# Altium schematic sheet Sheet2.SchDoc
size A4; SheetNumber: 2; SheetTotal: 2
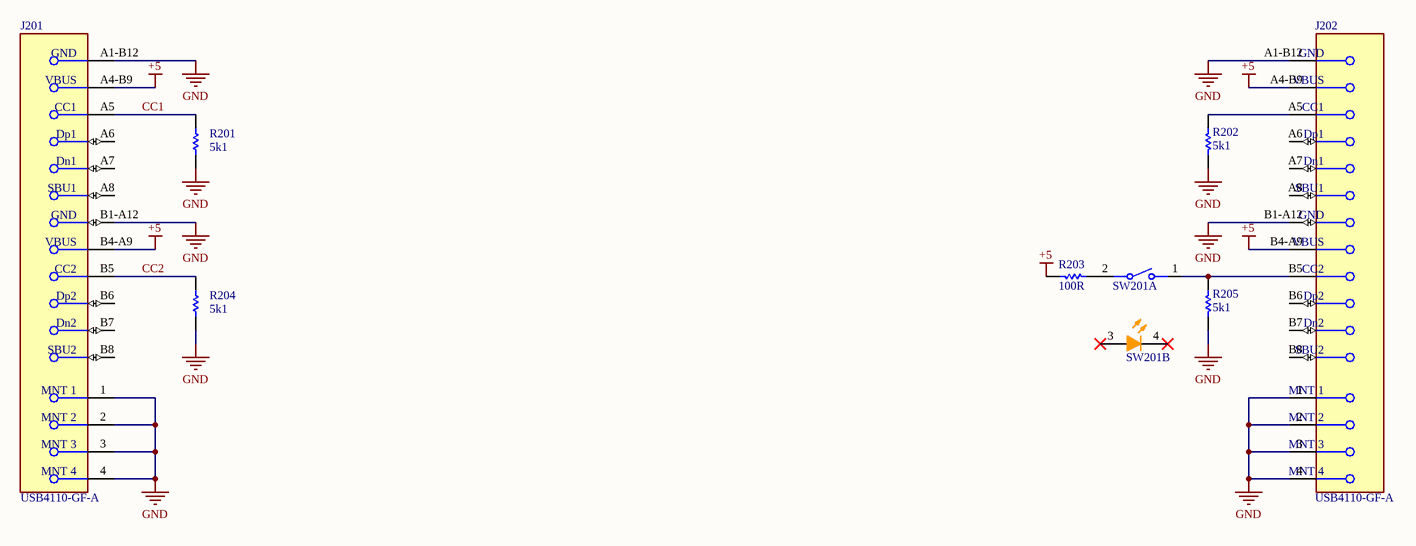
[diagram p0: Sheet2.SchDoc]

## Parts
J201  USB4110-GF-A  [FP-USB4110-GF-A-MFG]
J202  USB4110-GF-A  [FP-USB4110-GF-A-MFG]
R201  5k1  [RESC1608X06N]
R202  5k1  [RESC1608X06N]
R203  100R  [RESC1608X06N]
R204  5k1  [RESC1608X06N]
R205  5k1  [RESC1608X06N]
SW201  Switch  [CHRY-MX]  (value not drawn)  (parts A,B of 2)

## Nets
+5: J201.A4-B9(VBUS) J201.B4-A9(VBUS) J202.A4-B9(VBUS) J202.B4-A9(VBUS) R203.2
GND: J201.1(MNT_1) J201.2(MNT_2) J201.3(MNT_3) J201.4(MNT_4) J201.A1-B12(GND) J201.B1-A12(GND) J202.1(MNT_1) J202.2(MNT_2) J202.3(MNT_3) J202.4(MNT_4) J202.A1-B12(GND) J202.B1-A12(GND) R201.1 R202.1 R204.1 R205.1
CC1: J201.A5(CC1) R201.2
CC2: J201.B5(CC2) R204.2
NetJ202_A5: J202.A5(CC1) R202.2
NetJ202_B5: J202.B5(CC2) R205.2 SW201.1
NetR203_1: R203.1 SW201.2

Not connected (* = marked no-connect by the designer): J201 A6(Dp1) A7(Dn1) A8(SBU1) B6(Dp2) B7(Dn2) B8(SBU2); J202 A6(Dp1) A7(Dn1) A8(SBU1) B6(Dp2) B7(Dn2) B8(SBU2); SW201 3(A)* 4(K)*

## Library data of the parts
J201 J202 = CMP-245163-000002-1: CONN USB 2.0 TYPE-C R/A SMT; Manufacturer: GCT; Conn Orientation: Right Angle; Usb Standard: USB 2.0; Voltage Rating: 20V; Current Rating: 3/4.25/1.25/0.25A; Number Of Contacts: 16; Is Female: yes; Shielding: true; Standoff Height: 0.1mm; Octopart: https://octopart.com/usb4110-gf-a-gct-103941985; Temperature: -40°C to +85°C; RoHS: TRUE; Automotive: No; Contact Material: Gold,Nickel; Device Class L1: Connectors; Device Class L2: USB Connectors; Package: 0; Lead Free: Yes; ComponentLink2URL: https://gct.co/files/drawings/usb4110.pdf; Temperature Range High: +85°C; Temperature Range Low: -40°C; Height: 3.46mm; Manufacturer Part Number: USB4110-GF-A; ComponentLink2Description: Datasheet; Device Class L3: unset; Digikey Description: CONN USB 2.0 TYPE-C R/A SMT; Category: Conn
R201-R205 = R0603: Resistor; Value: *
SW201 = Cherry MX: Keylock Switch, 12 V, -10 to 70 degC, 2-Pin THD, RoHS, Bulk; Manufacturer: Cherry; Part No: MX1A11NW; Maximum DC Voltage Rating: 12V; COO: UK; Row Spacing: 6.35mm; Pole Throw Configuration: SPST; Total Travel: 4.06mm; Illumination Type: N/R; Actuator Style: Button; Operating Force: 0.58N; Electrical Life: 50000000Cycle; Minimum Insulation Resistance: 100MOhm; Body Orientation: Straight; Actuator Length: 3.6mm; Switch Configuration: N.O.; Maximum Current Rating: 0.01A; Maximum Contact Resistance: 200mOhm; Actuator Color: N/A; Terminal Type: PCPins; Operating Temperature: -10to70C; Number of Terminals: 2; Operating Speed: N/A; Maximum AC Voltage Rating: 12V; Housing Material: N/A; Datasheet URL: https://cdn.sparkfun.com/datasheets/Components/Switches/MX%20Series.pdf; Type: DesktopProfile; Terminal Pitch: 2.54mm; Package Reference: MX1A-11NW; ECCN: EAR99; Family: MX; Packaging: N/A; HTS: 8536509065; Actuator Material: N/A; Package Description: 2-Pin Through Hole Device, Body 15.6 x 15.6 mm; Dielectric Strength: N/A; Illumination Color: N/R; Manufacturer URL: http://cherryswitches.com/cn/; Dimension: 15.6x15.6x15.2mm; Mechanical Life: N/A; RoHS: Unknown; Contact Plating: N/A; Supplier: CherryElectrical; Contact Material: Silver/Gold; IP Rating: N/A; Mounting: ThroughHole; Datasheet Version: 09/2000; Maximum Power Rating: N/A; Mounting Technology: ThroughHole